# EAGLE schematic Rage Bridge v2 Schematic v58 (EAGLE 9.7.0)
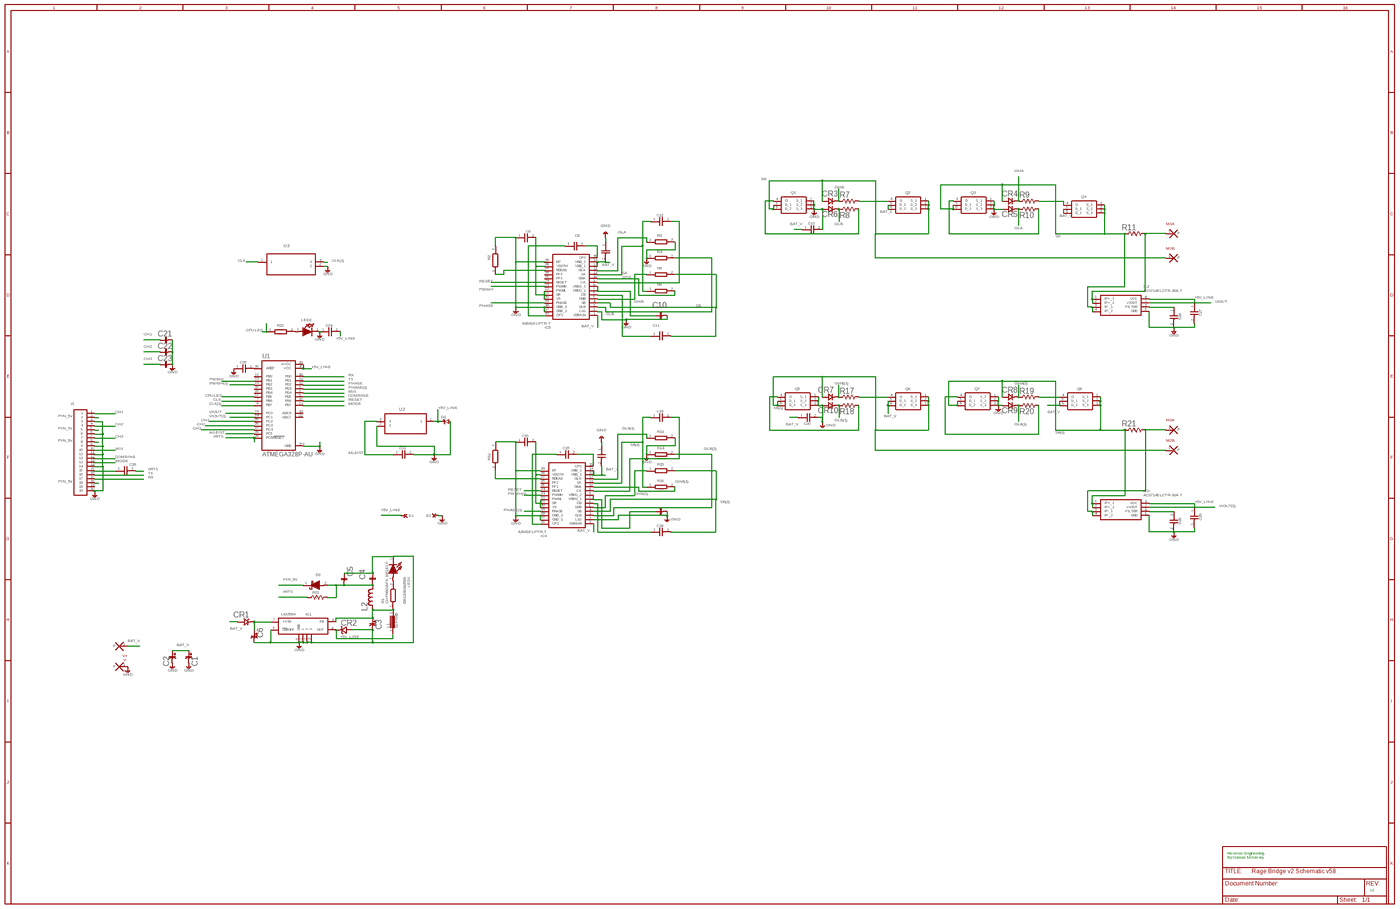
[diagram p0: schematic, sheet 1, overview]
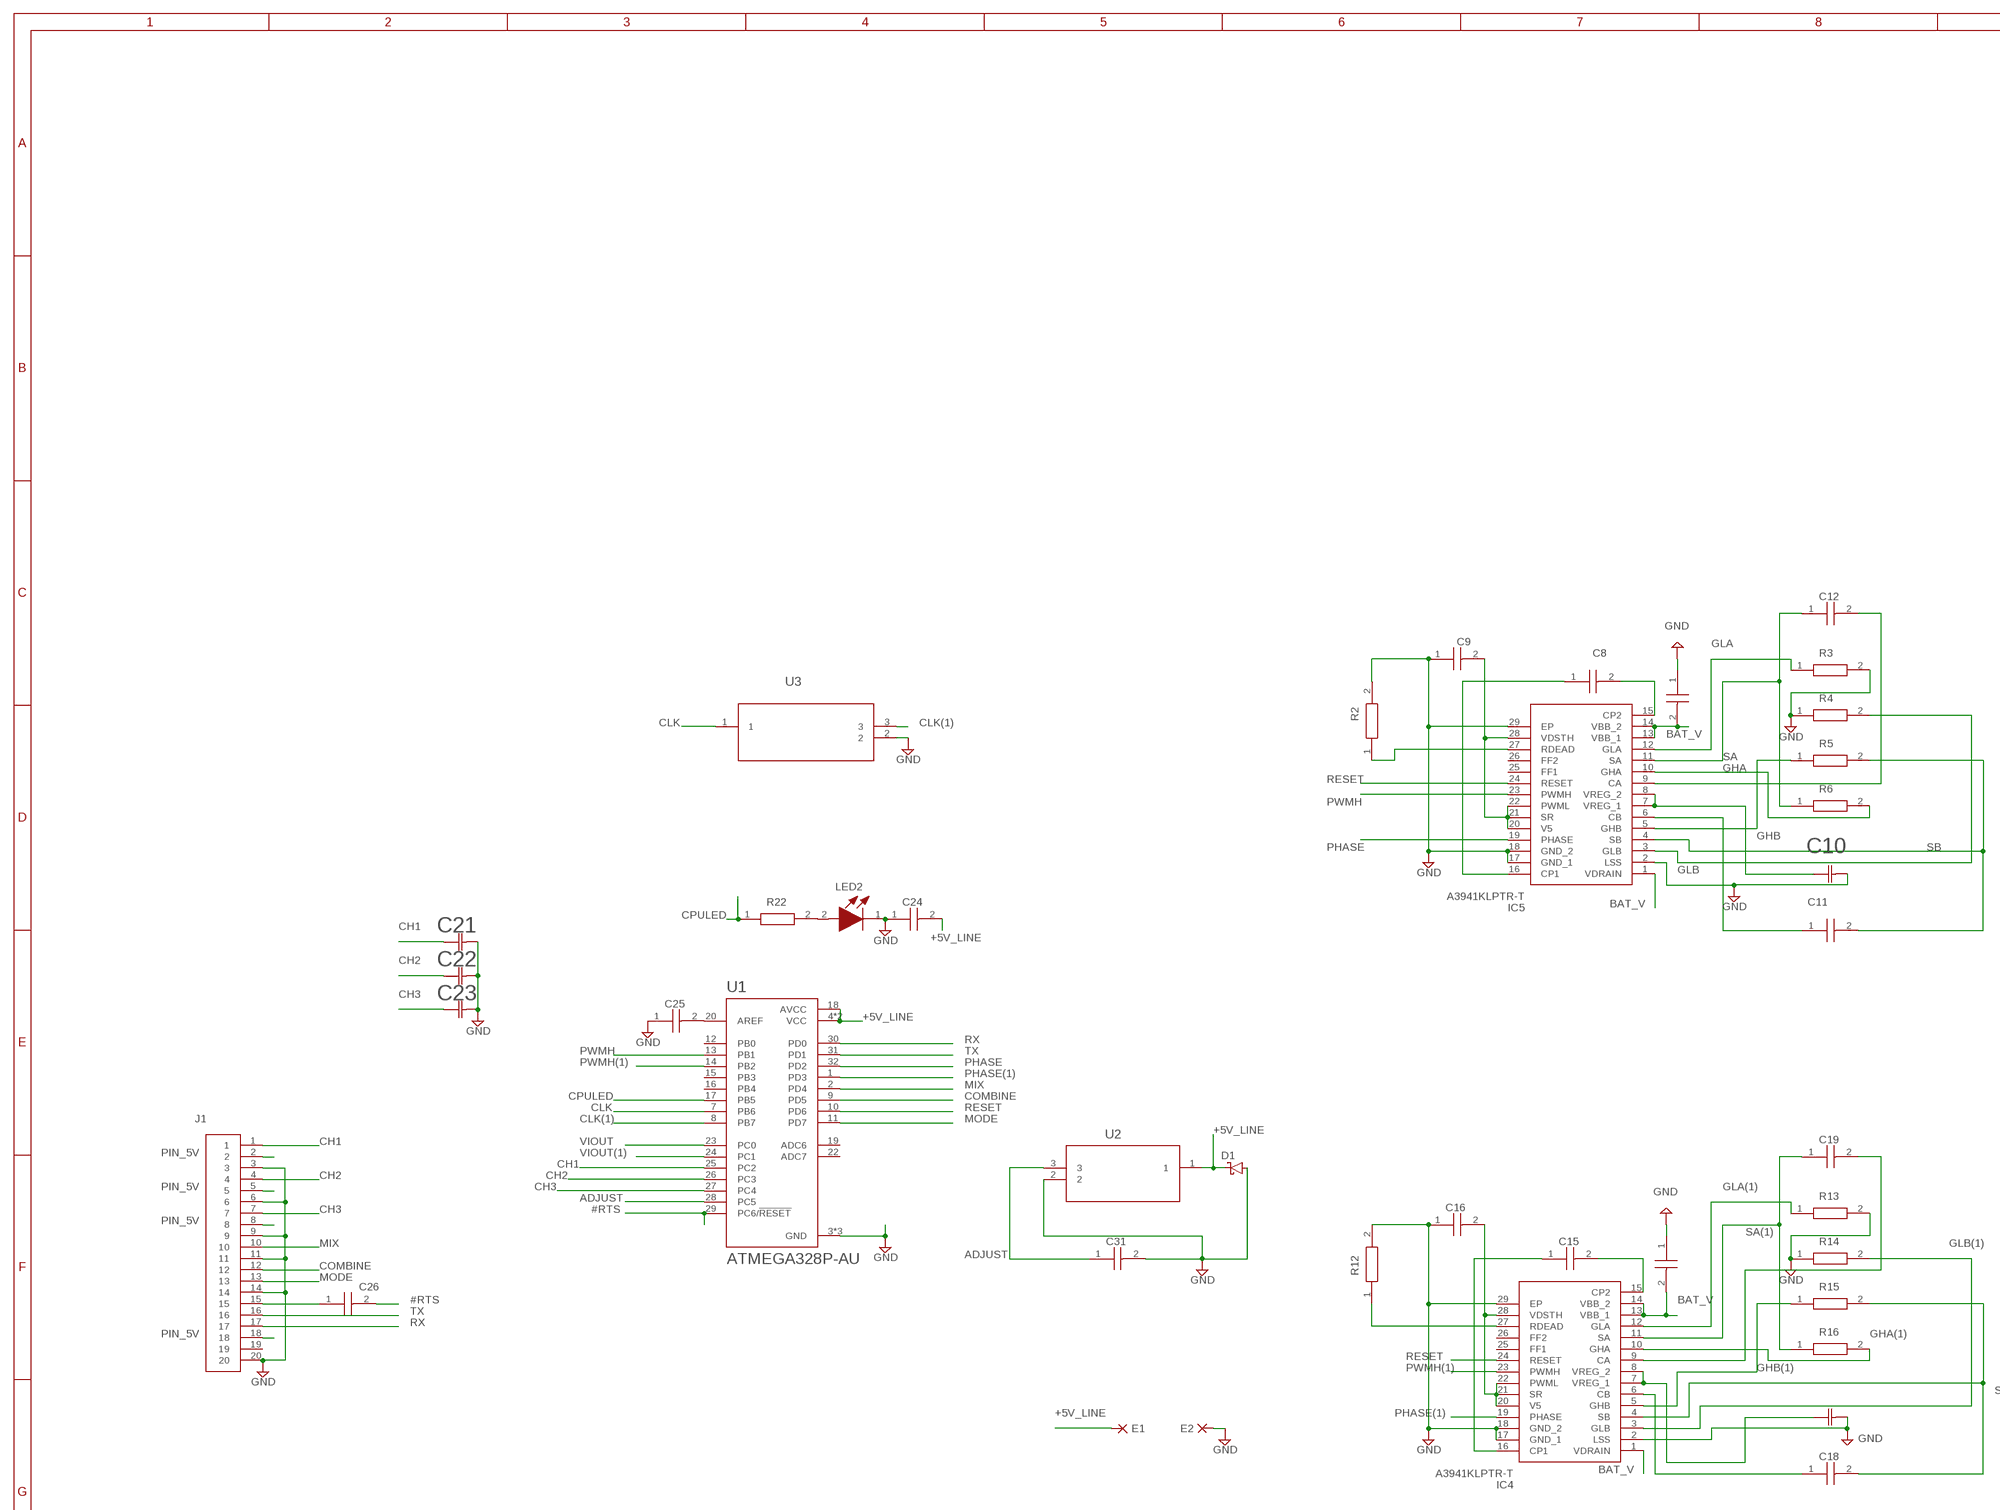
[diagram p1: schematic, sheet 1, part 1 of 4]
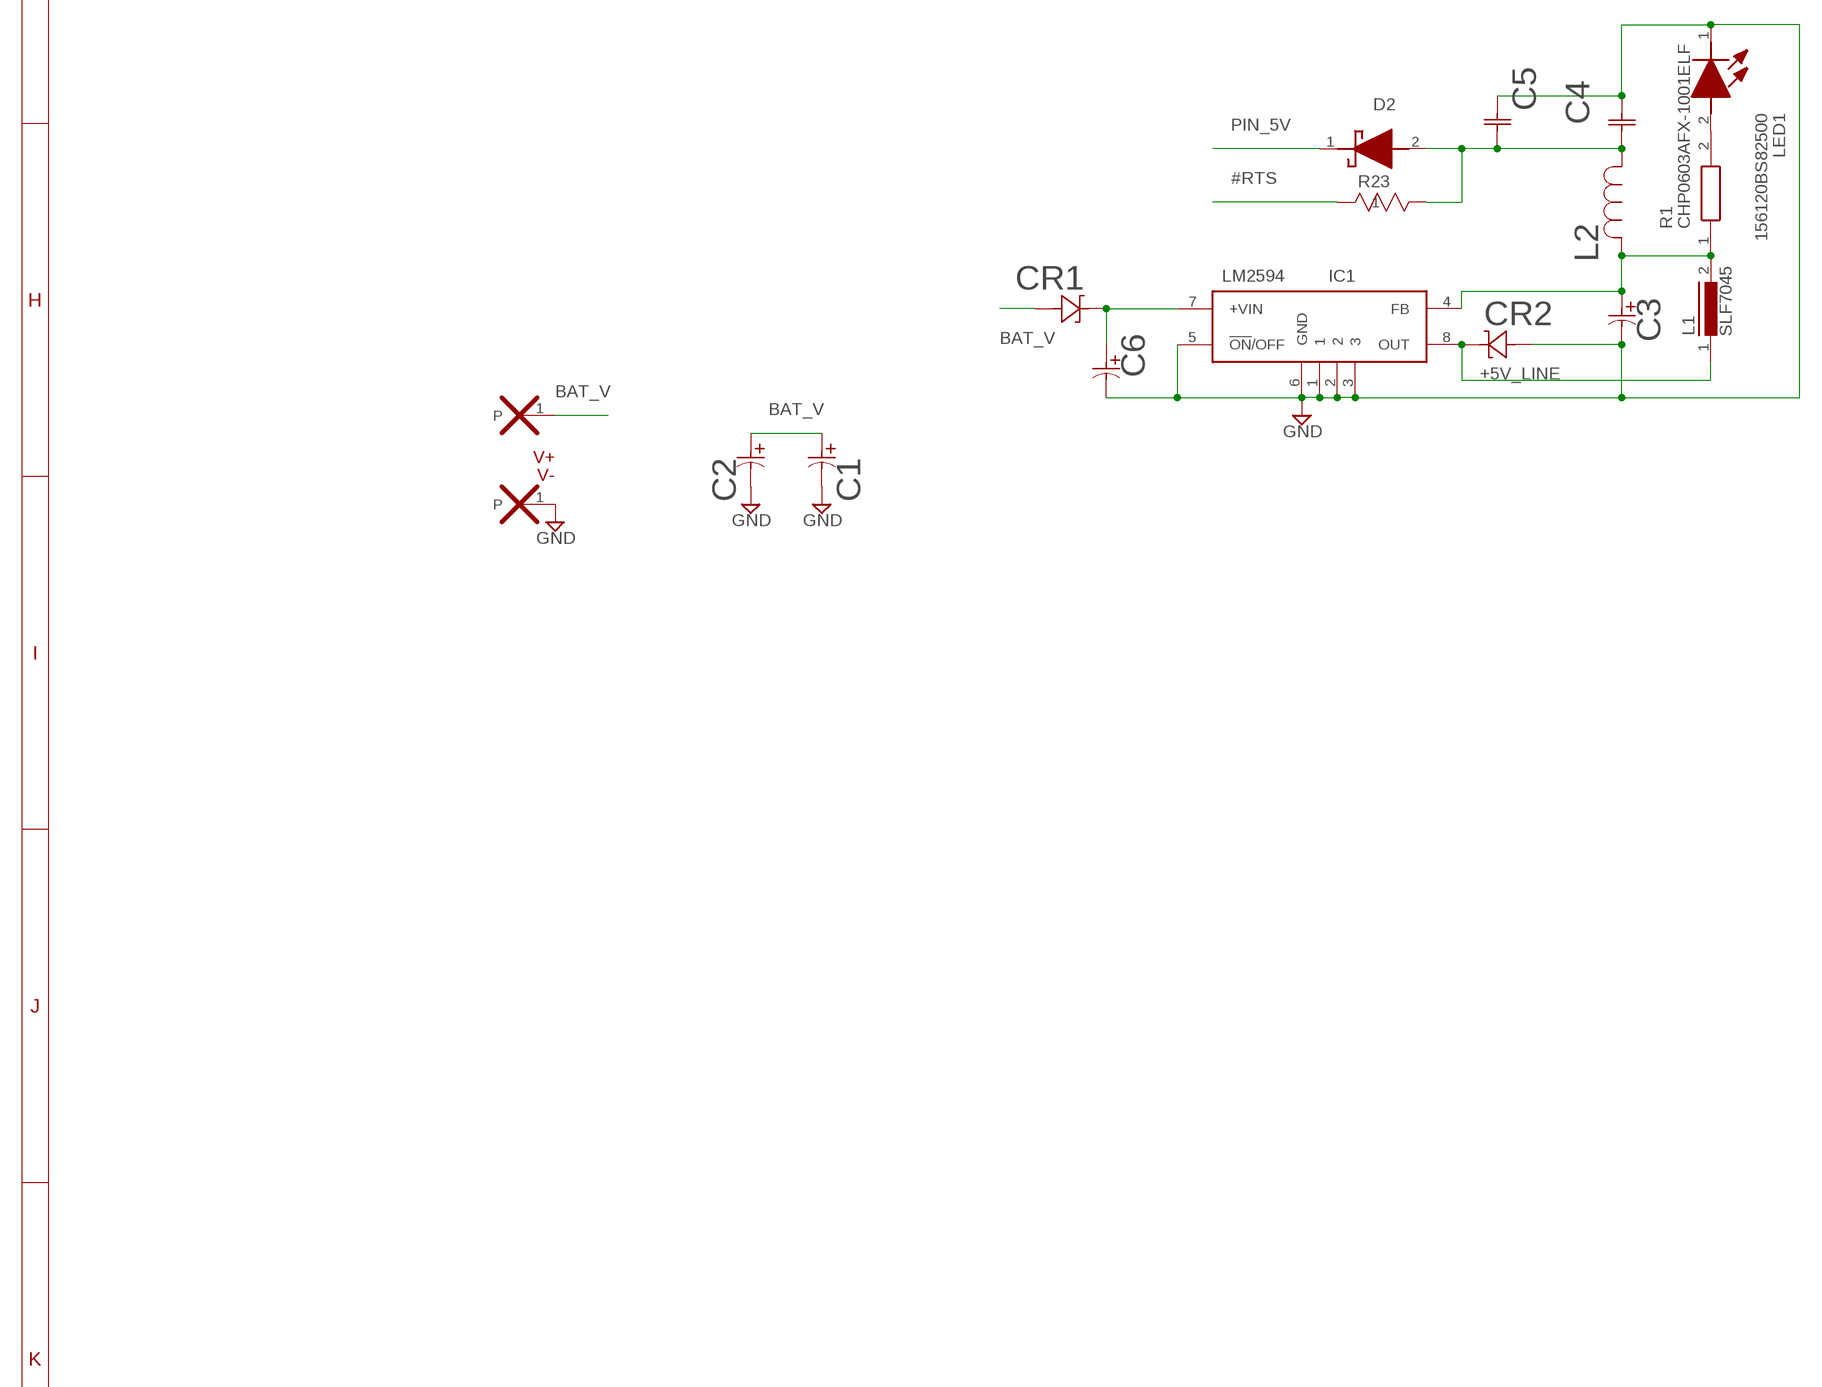
[diagram p2: schematic, sheet 1, part 2 of 4]
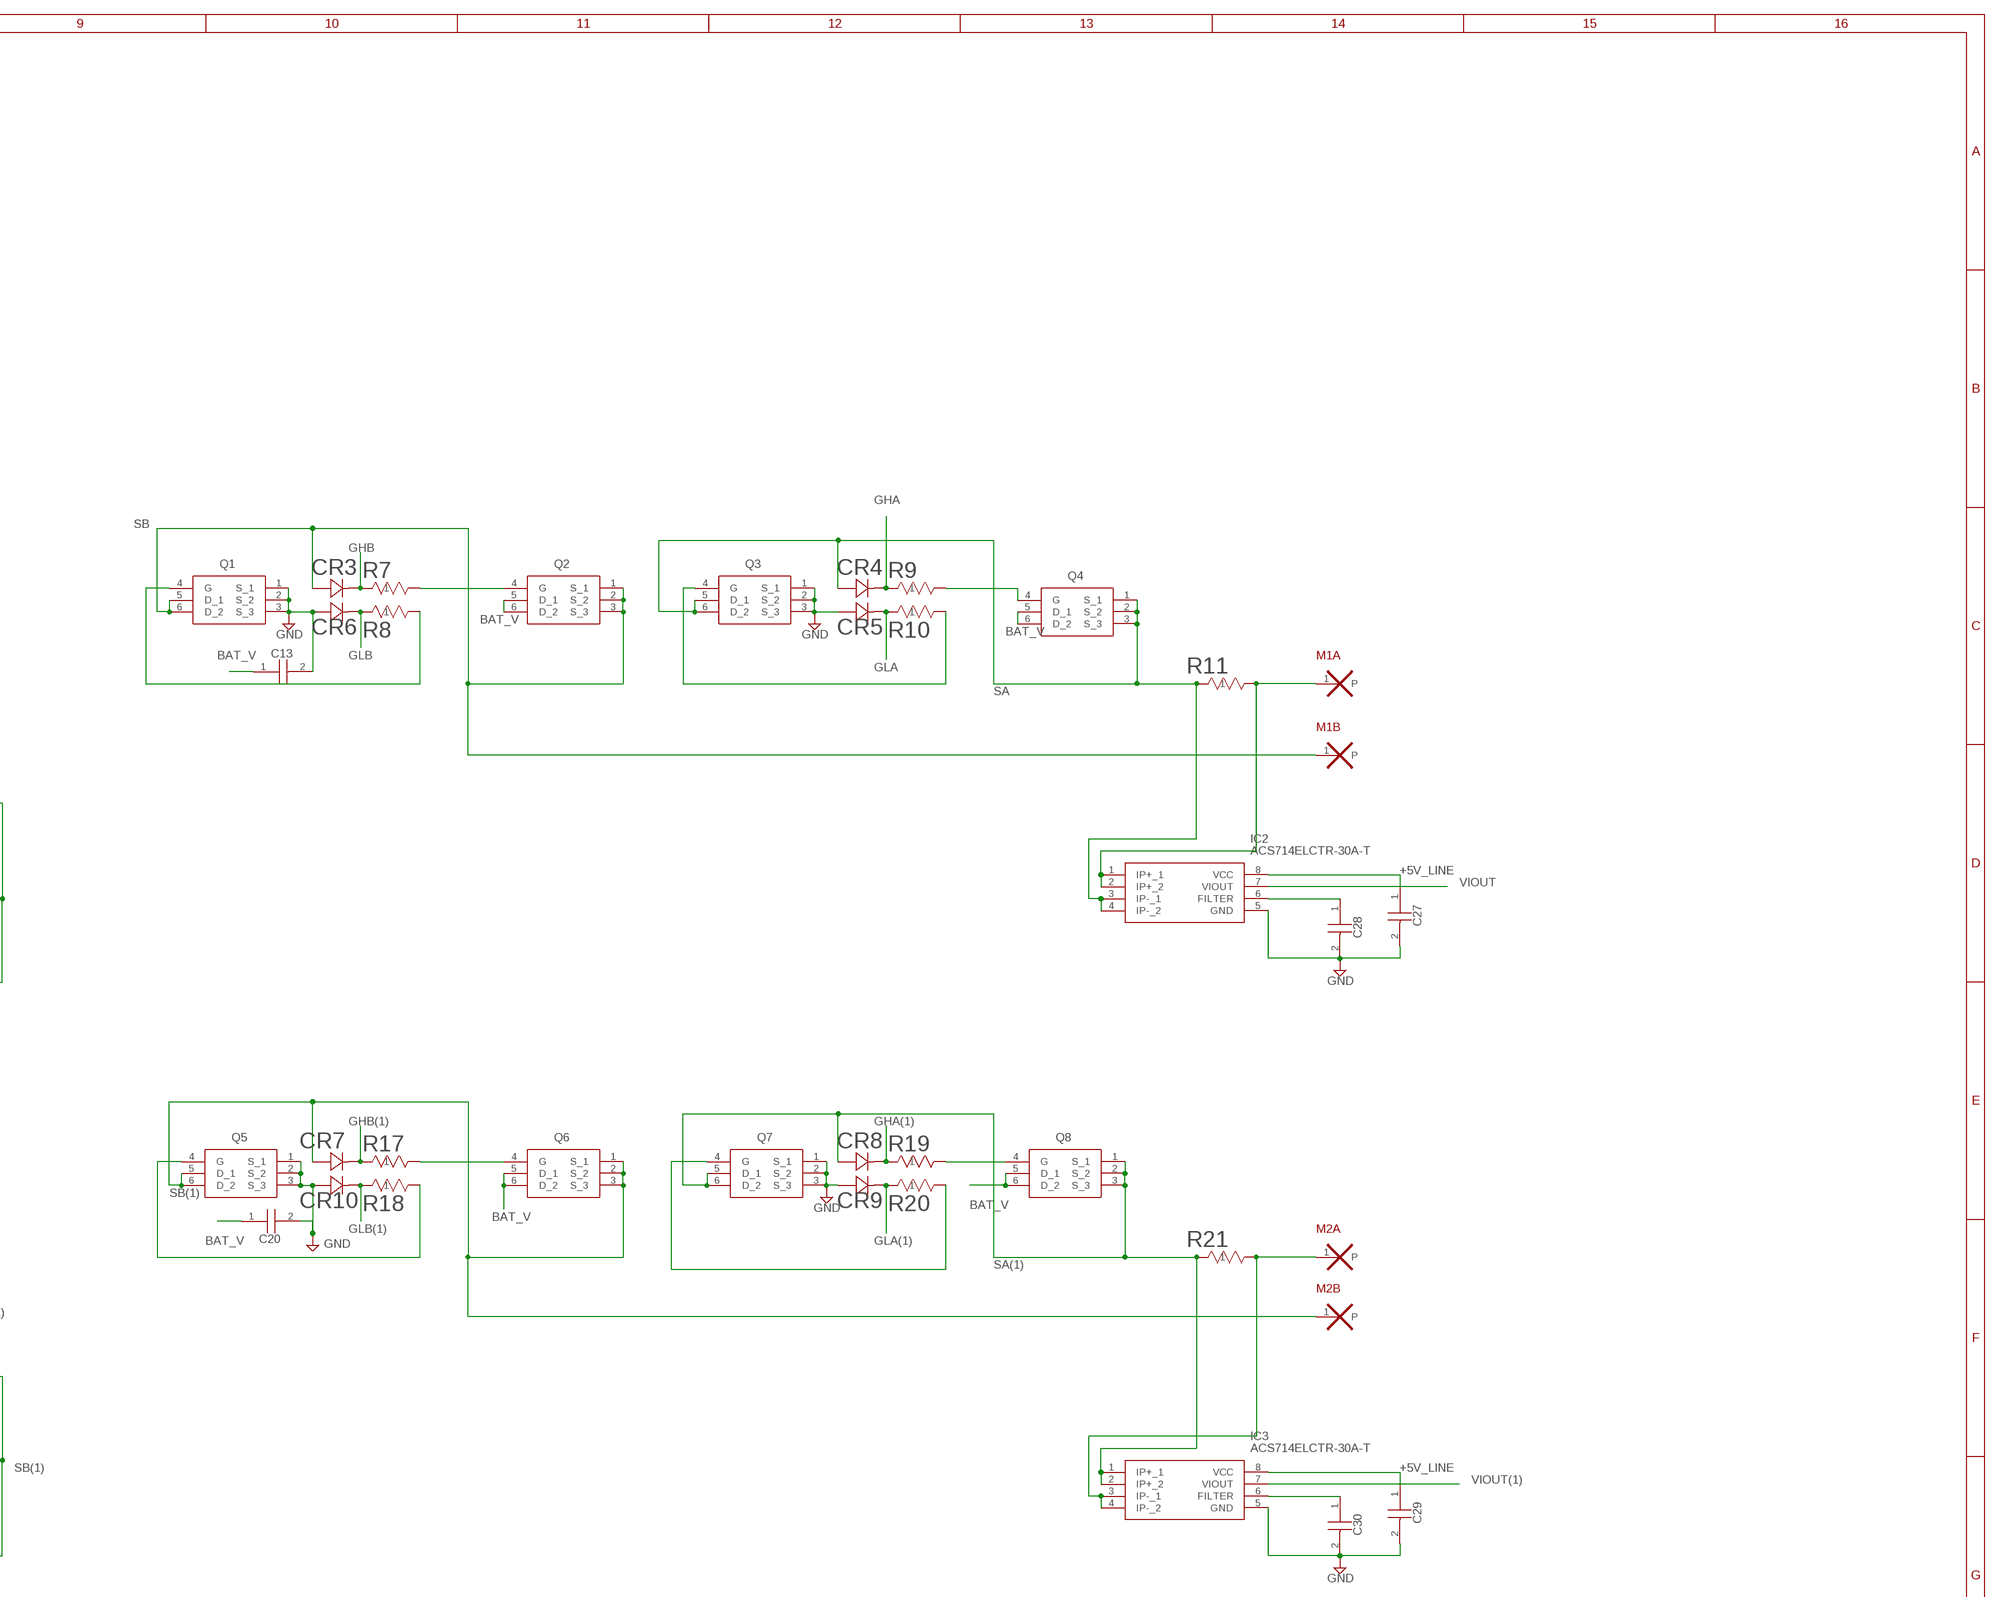
[diagram p3: schematic, sheet 1, part 3 of 4]
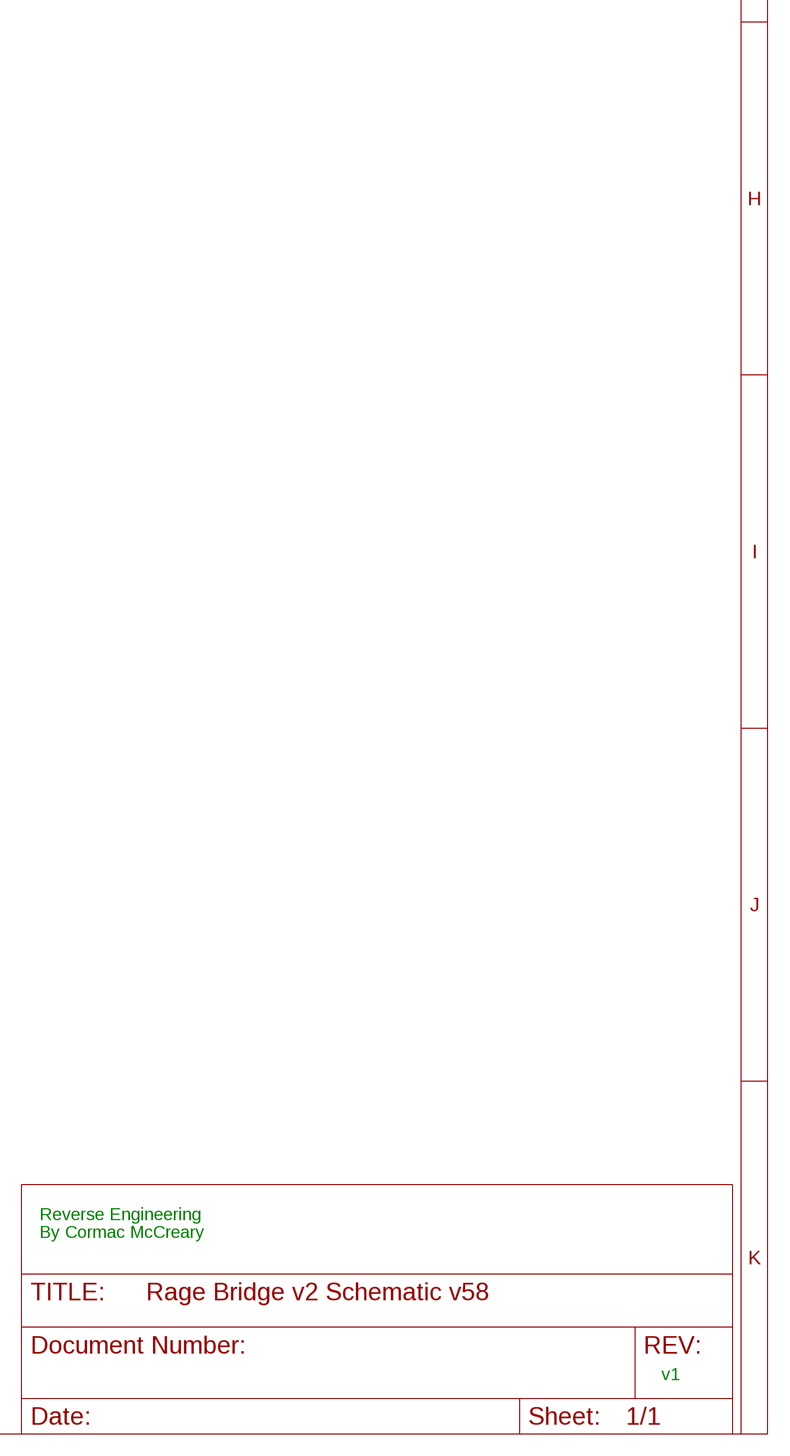
[diagram p4: schematic, sheet 1, part 4 of 4]

## Parts
C1  EEE-HD1V152AMCAP_PAN_EEE_J16_PAN-L  [CAP_PAN_EEE_J16_PAN-L]
C2  EEE-HD1V152AMCAP_PAN_EEE_J16_PAN-L  [CAP_PAN_EEE_J16_PAN-L]
C3  EEE-HA1C101WPCAP_PAN_EEE_D_PAN-L  [CAP_PAN_EEE_D_PAN-L]
C4  12066D107MAT2ACAP_1206X_AVX-L  [CAP_1206X_AVX-L]
C5  08056C104JAT2ACAP_08051A0R8CAT2A_AVX-L  [CAP_08051A0R8CAT2A_AVX-L]
C6  EEE-1VA470WAPCAP_PAN_EEE_D_PAN-L  [CAP_PAN_EEE_D_PAN-L]
C7  06035C105KAT2A  [CAPC1608X90N]
C8  06035C105KAT2A  [CAPC1608X90N]
C9  06035C105KAT2A  [CAPC1608X90N]
C10  08056C104JAT2ACAP_08051A0R8CAT2A_AVX-L  [CAP_08051A0R8CAT2A_AVX-L]
C11  06035C105KAT2A  [CAPC1608X90N]
C12  06035C105KAT2A  [CAPC1608X90N]
C13  06035C105KAT2A  [CAPC1608X90N]
C14  06035C105KAT2A  [CAPC1608X90N]
C15  06035C105KAT2A  [CAPC1608X90N]
C16  06035C105KAT2A  [CAPC1608X90N]
C17  08056C104JAT2ACAP_08051A0R8CAT2A_AVX-L  [CAP_08051A0R8CAT2A_AVX-L]
C18  06035C105KAT2A  [CAPC1608X90N]
C19  06035C105KAT2A  [CAPC1608X90N]
C20  06035C105KAT2A  [CAPC1608X90N]
C21  06036A152JAT2ACAP_06033D104JAT2A-L  [CAP_06033D104JAT2A-L]
C22  06036A152JAT2ACAP_06033D104JAT2A-L  [CAP_06033D104JAT2A-L]
C23  06036A152JAT2ACAP_06033D104JAT2A-L  [CAP_06033D104JAT2A-L]
C24  06035C105KAT2A  [CAPC1608X90N]
C25  06035C105KAT2A  [CAPC1608X90N]
C26  GCM188R71C104KA37J  [CAPC1608X90N]
C27  C0603X102K5GACAUTO  [CAPC1608X95N]
C28  06035C105KAT2A  [CAPC1608X90N]
C29  C0603X102K5GACAUTO  [CAPC1608X95N]
C30  06035C105KAT2A  [CAPC1608X90N]
C31  C0603X102K5GACAUTO  [CAPC1608X95N]
CR1  STPS0560ZSOD-123_STM  [SOD-123_STM]
CR2  STPS0560ZSOD-123_STM-L  [SOD-123_STM-L]
CR3  SMF16ASMFSERIES_LTF-L  [SMFSERIES_LTF-L]
CR4  SMF16ASMFSERIES_LTF-L  [SMFSERIES_LTF-L]
CR5  SMF16ASMFSERIES_LTF-L  [SMFSERIES_LTF-L]
CR6  SMF16ASMFSERIES_LTF-L  [SMFSERIES_LTF-L]
CR7  SMF16ASMFSERIES_LTF-L  [SMFSERIES_LTF-L]
CR8  SMF16ASMFSERIES_LTF-L  [SMFSERIES_LTF-L]
CR9  SMF16ASMFSERIES_LTF-L  [SMFSERIES_LTF-L]
CR10  SMF16ASMFSERIES_LTF-L  [SMFSERIES_LTF-L]
D1  SMF5.0AT1  [SOD123FL]
D2  SD0805S020S1R0  [SD0805S020S1R0]
E1  DPADS_PAD-0400-S  [DPADS_0400-S]
E2  DPADS_PAD-0400-S  [DPADS_0400-S]
IC1  LM2594  [TSOP8]
IC2  ACS714ELCTR-30A-T  [ACS711ELCTR25ABT]
IC3  ACS714ELCTR-30A-T  [ACS711ELCTR25ABT]
IC4  A3941KLPTR-T  [A3944KLPTRT]
IC5  A3941KLPTR-T  [A3944KLPTRT]
J1  61302011121  [61302011121]
L1  SLF7045  [SLF7045]
L2  NLFV32T-3R3M-EFIND_NLFV32T_TDK  [IND_NLFV32T_TDK]
LED1  156120BS82500  [LEDC3216X195N]
LED2  156120BS82500  [LEDC3216X195N]
M1A  4.95/3.55WIREPAD  [4.95/3.55]
M1B  4.95/3.55WIREPAD  [4.95/3.55]
M2A  4.95/3.55WIREPAD  [4.95/3.55]
M2B  4.95/3.55WIREPAD  [4.95/3.55]
Q1  PSMNR90-40YLHX  [PSMN2R055YLHX]
Q2  PSMNR90-40YLHX  [PSMN2R055YLHX]
Q3  PSMNR90-40YLHX  [PSMN2R055YLHX]
Q4  PSMNR90-40YLHX  [PSMN2R055YLHX]
Q5  PSMNR90-40YLHX  [PSMN2R055YLHX]
Q6  PSMNR90-40YLHX  [PSMN2R055YLHX]
Q7  PSMNR90-40YLHX  [PSMN2R055YLHX]
Q8  PSMNR90-40YLHX  [PSMN2R055YLHX]
R1  CHP0603AFX-1001ELF  [RESC1608X55N]
R2  ERA-3VEB2202V  [ERA3KV_(0603)]
R3  CR0603-FX-2703ELF  [RESC1608X55N]
R4  CR0603-FX-2703ELF  [RESC1608X55N]
R5  CR0603-FX-2703ELF  [RESC1608X55N]
R6  CR0603-FX-2703ELF  [RESC1608X55N]
R7  TNPW0603100KBEEARES_TNPW0603_VIS-L  [RES_TNPW0603_VIS-L]
R8  TNPW0603100KBEEARES_TNPW0603_VIS-L  [RES_TNPW0603_VIS-L]
R9  TNPW0603100KBEEARES_TNPW0603_VIS-L  [RES_TNPW0603_VIS-L]
R10  TNPW0603100KBEEARES_TNPW0603_VIS-L  [RES_TNPW0603_VIS-L]
R11  CSNL2512FTL500STA_CSNL2512(0.5)_STP-L  [STA_CSNL2512(0.5)_STP-L]
R12  ERA-3VEB2202V  [ERA3KV_(0603)]
R13  CR0603-FX-2703ELF  [RESC1608X55N]
R14  CR0603-FX-2703ELF  [RESC1608X55N]
R15  CR0603-FX-2703ELF  [RESC1608X55N]
R16  CR0603-FX-2703ELF  [RESC1608X55N]
R17  TNPW0603100KBEEARES_TNPW0603_VIS-L  [RES_TNPW0603_VIS-L]
R18  TNPW0603100KBEEARES_TNPW0603_VIS-L  [RES_TNPW0603_VIS-L]
R19  TNPW0603100KBEEARES_TNPW0603_VIS-L  [RES_TNPW0603_VIS-L]
R20  TNPW0603100KBEEARES_TNPW0603_VIS-L  [RES_TNPW0603_VIS-L]
R21  CSNL2512FTL500STA_CSNL2512(0.5)_STP-L  [STA_CSNL2512(0.5)_STP-L]
R22  CHP0603AFX-1001ELF  [RESC1608X55N]
R23  CHP0603AFX-1003ELFRES_CHP0603_BRN-L  [RES_CHP0603_BRN-L]
U1  ATMEGA328P-AU  [QFP80P900X900X120-32N]
U2  ST-4ETB502ST-4ETB502_NDC-L  [ST-4ETB502_NDC-L]
U3  CSTCE16M0V53A-R0CSTCE_V_MUR  [CSTCE_V_MUR]
V+  4.95/3.55WIREPAD  [4.95/3.55]
V-  4.95/3.55WIREPAD  [4.95/3.55]

## Nets
#RTS: C26.2 R23.1 U1.29(PC6/!RESET)
+5V_LINE: C4.1 C5.2 C24.2 C27.1 C29.1 D1.C D2.2(A) E1.PAD(P) IC2.8(VCC) IC3.8(VCC) L2.1 R23.2 U1.4(VCC) U1.6(VCC) U1.18(AVCC) U2.1
ADJUST: C31.1 U1.28(PC5) U2.3
BAT_V: C1.1 C2.1 C7.2 C13.1 C14.2 C20.1 CR1.2 IC4.1(VDRAIN) IC4.13(VBB_1) IC4.14(VBB_2) IC5.1(VDRAIN) IC5.13(VBB_1) IC5.14(VBB_2) Q2.5(D_1) Q2.6(D_2) Q4.5(D_1) Q4.6(D_2) Q6.5(D_1) Q6.6(D_2) Q8.5(D_1) Q8.6(D_2) V+.1(P)
CH1: C21.1(EPAD) J1.1 U1.25(PC2)
CH2: C22.1(EPAD) J1.4 U1.26(PC3)
CH3: C23.1(EPAD) J1.7 U1.27(PC4)
CLK: U1.7(PB6) U3.1
CLK(1): U1.8(PB7) U3.3
COMBINE: J1.12 U1.9(PD5)
CPULED: R22.1 U1.17(PB5)
GHA: CR4.1 IC5.10(GHA) R6.2 R9.1
GHA(1): CR8.1 IC4.10(GHA) R16.2 R19.1
GHB: CR3.1 IC5.5(GHB) R5.1 R7.1
GHB(1): CR7.1 IC4.5(GHB) R15.1 R17.1
GLA: CR5.1 IC5.12(GLA) R3.1 R10.1
GLA(1): CR9.1 IC4.12(GLA) R13.1 R20.1
GLB: CR6.1 IC5.3(GLB) R4.2 R8.1
GLB(1): CR10.1 IC4.3(GLB) R14.2 R18.1
GND: C1.2 C2.2 C3.2 C4.2 C5.1 C6.2 C7.1 C9.1 C10.2 C13.2 C14.1 C16.1 C17.2 C20.2 C21.2(EPAD_2) C22.2(EPAD_2) C23.2(EPAD_2) C24.1 C25.1 C27.2 C28.2 C29.2 C30.2 C31.2 CR2.2 CR5.2 CR6.2 CR9.2 CR10.2 D1.A E2.PAD(P) IC1.1 IC1.2 IC1.3 IC1.5(!ON!/OFF) IC1.6(GND) IC2.5(GND) IC3.5(GND) IC4.2(LSS) IC4.17(GND_1) IC4.18(GND_2) IC4.29(EP) IC5.2(LSS) IC5.17(GND_1) IC5.18(GND_2) IC5.29(EP) J1.3 J1.6 J1.9 J1.11 J1.14 J1.20 LED1.1(K) LED2.1(K) Q1.1(S_1) Q1.2(S_2) Q1.3(S_3) Q3.1(S_1) Q3.2(S_2) Q3.3(S_3) Q5.1(S_1) Q5.2(S_2) Q5.3(S_3) Q7.1(S_1) Q7.2(S_2) Q7.3(S_3) R2.2 R3.2 R4.1 R12.2 R13.2 R14.1 U1.3(GND) U1.5(GND) U1.21(GND) U2.2 U3.2 V-.1(P)
MIX: J1.10 U1.2(PD4)
MODE: J1.13 U1.11(PD7)
N$1: C12.2 IC5.9(CA)
N$2: C8.2 IC5.15(CP2)
N$3: C6.1 CR1.1 IC1.7(+VIN)
N$5: CR2.1 IC1.8(OUT) L1.1
N$6: C3.1 IC1.4(FB) L1.2 L2.2 R1.1
N$7: IC2.1(IP+_1) IC2.2(IP+_2) M1A.1(P) R11.2
N$8: LED1.2(A) R1.2
N$9: IC5.27(RDEAD) R2.1
N$11: C11.1 IC5.6(CB)
N$12: C17.1 IC4.7(VREG_1) IC4.8(VREG_2)
N$15: Q2.4(G) R7.2
N$16: Q8.4(G) R19.2
N$18: C16.2 IC4.20(V5) IC4.21(SR) IC4.22(PWML) IC4.28(VDSTH)
N$22: C15.1 IC4.16(CP1)
N$23: C15.2 IC4.15(CP2)
N$24: IC3.3(IP-_1) IC3.4(IP-_2) M2A.1(P) R21.2
N$29: Q6.4(G) R17.2
N$31: Q1.4(G) R8.2
N$32: Q3.4(G) R10.2
N$33: C26.1 J1.15
N$34: IC4.27(RDEAD) R12.1
N$35: C10.1 IC5.7(VREG_1) IC5.8(VREG_2)
N$36: C8.1 IC5.16(CP1)
N$39: C9.2 IC5.20(V5) IC5.21(SR) IC5.22(PWML) IC5.28(VDSTH)
N$41: C19.2 IC4.9(CA)
N$42: C18.1 IC4.6(CB)
N$49: Q5.4(G) R18.2
N$50: Q7.4(G) R20.2
N$52: C28.1 IC2.6(FILTER)
N$61: LED2.2(A) R22.2
N$63: C25.2 U1.20(AREF)
N$73: C30.1 IC3.6(FILTER)
N$79: Q4.4(G) R9.2
PHASE: IC5.19(PHASE) U1.32(PD2)
PHASE(1): IC4.19(PHASE) U1.1(PD3)
PIN_5V: D2.1(K) J1.2 J1.5 J1.8 J1.18
PWMH: IC5.23(PWMH) U1.13(PB1)
PWMH(1): IC4.23(PWMH) U1.14(PB2)
RESET: IC4.24(RESET) IC5.24(RESET) U1.10(PD6)
RX: J1.17 U1.30(PD0)
SA: C12.1 CR4.2 IC2.3(IP-_1) IC2.4(IP-_2) IC5.11(SA) Q3.5(D_1) Q3.6(D_2) Q4.1(S_1) Q4.2(S_2) Q4.3(S_3) R6.1 R11.1
SA(1): C19.1 CR8.2 IC3.1(IP+_1) IC3.2(IP+_2) IC4.11(SA) Q7.5(D_1) Q7.6(D_2) Q8.1(S_1) Q8.2(S_2) Q8.3(S_3) R16.1 R21.1
SB: C11.2 CR3.2 IC5.4(SB) M1B.1(P) Q1.5(D_1) Q1.6(D_2) Q2.1(S_1) Q2.2(S_2) Q2.3(S_3) R5.2
SB(1): C18.2 CR7.2 IC4.4(SB) M2B.1(P) Q5.5(D_1) Q5.6(D_2) Q6.1(S_1) Q6.2(S_2) Q6.3(S_3) R15.2
TX: J1.16 U1.31(PD1)
VIOUT: IC2.7(VIOUT) U1.23(PC0)
VIOUT(1): IC3.7(VIOUT) U1.24(PC1)
Unconnected: IC4.25(FF1) IC4.26(FF2) IC5.25(FF1) IC5.26(FF2) J1.19 U1.12(PB0) U1.15(PB3) U1.16(PB4) U1.19(ADC6) U1.22(ADC7)

## Notes on the sheet
- Reverse Engineering
- By Cormac McCreary
- v1

## Library data of the parts
C1 C2 = Library:EEE-HD1V152AM; COPYRIGHT: Copyright (C) 2023 Ultra Librarian. All rights reserved.; MANUFACTURER_PART_NUMBER: EEE-HD1V152AM; MFR_NAME: Panasonic
C3 = Modified Parts:EEE-HA1C101WP; COPYRIGHT: Copyright (C) 2023 Ultra Librarian. All rights reserved.; DIGI-KEY_PART_NUMBER_1: PCE4180TR-ND; DIGI-KEY_PART_NUMBER_2: PCE4180CT-ND; DIGI-KEY_PART_NUMBER_3: PCE4180DKR-ND; MANUFACTURER_PART_NUMBER: EEE-HA1C101WP; MFR_NAME: Panasonic
C4 = 581-12066D107MAT2A:12066D107MAT2A; COPYRIGHT: Copyright (C) 2023 Ultra Librarian. All rights reserved.; MANUFACTURER_PART_NUMBER: 12066D107MAT2A; MFR_NAME: KYOCERA AVX
C5 C10 C17 = 08056C106MAT2A:08056C104JAT2A; COPYRIGHT: Copyright (C) 2023 Ultra Librarian. All rights reserved.; MANUFACTURER_PART_NUMBER: 08056C104JAT2A; MFR_NAME: KYOCERA AVX
C6 = Modified Parts:EEE-1VA470WAP; COPYRIGHT: Copyright (C) 2023 Ultra Librarian. All rights reserved.; MANUFACTURER_PART_NUMBER: EEE-1VA470WAP; MFR_NAME: Panasonic
C7-C9 C11-C16 C18-C20 C24 C25 C28 C30 = 06035C105KAT2A:06035C105KAT2A: Multilayer Ceramic Capacitors MLCC - SMD/SMT 1.0UF 50V 10% 0603 Source: Datasheet <https://componentsearchengine.com/Datasheets/1/06031A100FAT2A.pdf>; DESCRIPTION: Multilayer Ceramic Capacitors MLCC - SMD/SMT 1.0UF 50V 10% 0603; HEIGHT: 0.9mm; MANUFACTURER_NAME: AVX; MANUFACTURER_PART_NUMBER: 06035C105KAT2A; MOUSER_PART_NUMBER: 581-06035C105KAT2A; MOUSER_PRICE-STOCK: https://www.mouser.co.uk/ProductDetail/AVX/06035C105KAT2A/?qs=%252BdQmOuGyFcGCdIIWh6fU7Q%3D%3D
C21-C23 = 06036A152JAT2A:06036A152JAT2A; COPYRIGHT: Copyright (C) 2023 Ultra Librarian. All rights reserved.; MANUFACTURER_PART_NUMBER: 06036A152JAT2A; MFR_NAME: KYOCERA AVX
C26 = GCM188R71C104KA37J:GCM188R71C104KA37J: Multilayer Ceramic Capacitors MLCC - SMD/SMT .1uF 16Volts 10% Source: Datasheet <https://datasheet.datasheetarchive.com/originals/distributors/Datasheets_SAMA/6a84f22995587894cf4220b9e75711fd.pdf>; DESCRIPTION: Multilayer Ceramic Capacitors MLCC - SMD/SMT .1uF 16Volts 10%; HEIGHT: 0.9mm; MANUFACTURER_NAME: Murata Electronics; MANUFACTURER_PART_NUMBER: GCM188R71C104KA37J; MOUSER_PART_NUMBER: 81-GCM188R71C104KA7J; MOUSER_PRICE-STOCK: https://www.mouser.co.uk/ProductDetail/Murata-Electronics/GCM188R71C104KA37J?qs=bGEzvQhTDnZD08oWyjLpYQ%3D%3D
C27 C29 C31 = C0603X102K5GACAUTO:C0603X102K5GACAUTO: SMD Auto C0G Flex, Ceramic, 1000 pF, 10%, 50 VDC, 125 VDC, 125C, -55C, C0G, SMD, MLCC, FT-CAP, Ultra-Stable, Automotive Grade, 0.1 % , 100 GOhms, 4.6 mg, 0603, 1.6mm, 0.8mm, 0.8mm, 0.58mm, 0.45mm, 4000, 78 Weeks, 120 Source: Datasheet <https://content.kemet.com/datasheets/KEM_C1062_C0G_FT-CAP_SMD.pdf>; DESCRIPTION: SMD Auto C0G Flex, Ceramic, 1000 pF, 10%, 50 VDC, 125 VDC, 125C, -55C, C0G, SMD, MLCC, FT-CAP, Ultra-Stable, Automotive Grade, 0.1 % , 100 GOhms, 4.6 mg, 0603, 1.6mm, 0.8mm, 0.8mm, 0.58mm, 0.45mm, 4000, 78 Weeks, 120; HEIGHT: 0.95mm; MANUFACTURER_NAME: KEMET; MANUFACTURER_PART_NUMBER: C0603X102K5GACAUTO; MOUSER_PART_NUMBER: 80-C0603X102K5GAUTO; MOUSER_PRICE-STOCK: https://www.mouser.co.uk/ProductDetail/KEMET/C0603X102K5GACAUTO?qs=Rp5uXu7WBW%2FQ943CZtK%2F6w%3D%3D
CR1 CR2 = Modified Parts:STPS0560Z; COPYRIGHT: Copyright (C) 2023 Ultra Librarian. All rights reserved.; MANUFACTURER_PART_NUMBER: STPS0560Z; MFR_NAME: STMicroelectronics
CR3-CR10 = Modified Parts:SMF16A; COPYRIGHT: Copyright (C) 2023 Ultra Librarian. All rights reserved.; MANUFACTURER_PART_NUMBER: SMF16A; MFR_NAME: Littelfuse Inc
D1 = diode:SMF5.0AT1: 200 W Transient Voltage Suppressor Source: Data sheet <http://www.onsemi.com/pub_link/Collateral/SMF5.0AT1-D.PDF>
D2 = SD0805S020S1R0:SD0805S020S1R0: AVX - SD0805S020S1R0 - DIODE, SCHOTTKY, 1A, 20V, SOD-323 Source: Datasheet <https://componentsearchengine.com/Datasheets/1/SD0805S020S1R0.pdf>; DESCRIPTION: AVX - SD0805S020S1R0 - DIODE, SCHOTTKY, 1A, 20V, SOD-323; HEIGHT: 1mm; MANUFACTURER_NAME: AVX; MANUFACTURER_PART_NUMBER: SD0805S020S1R0; MOUSER_PART_NUMBER: 581-SD0805S020S1R0; MOUSER_PRICE-STOCK: https://www.mouser.co.uk/ProductDetail/AVX-Kyocera/SD0805S020S1R0?qs=jCA%252BPfw4LHbpkAoSnwrdjw%3D%3D
E1 E2 = 52101-101-REV-A_v16:DPADS_PAD: WIRE PAD Standard US Drill Sizes and SMD pads; BOM: EXCLUDE
IC1 = LM2594:LM2594: Power Converter 150kHz 0.5A Step-Down Voltage Regulator
IC2 IC3 = ACS714ELCTR-30A-T:ACS714ELCTR-30A-T: Automotive Grade, Fully Integrated, Hall-Effect-Based Linear Current Sensor IC with 2.1 kVRMS Voltage Isolation and a Low-Resistance Current Conductor Source: Datasheet <https://www.allegromicro.com/-/media/files/datasheets/acs714-datasheet.ashx>; ARROW_PART_NUMBER: ACS714ELCTR-30A-T; ARROW_PRICE-STOCK: https://www.arrow.com/en/products/acs714elctr-30a-t/allegro-microsystems?region=nac; DESCRIPTION: Automotive Grade, Fully Integrated, Hall-Effect-Based Linear Current Sensor IC with 2.1 kVRMS Voltage Isolation and a Low-Resistance Current Conductor; HEIGHT: 1.75mm; MANUFACTURER_NAME: Allegro Microsystems; MANUFACTURER_PART_NUMBER: ACS714ELCTR-30A-T
IC4 IC5 = A3941KLPTR-T:A3941KLPTR-T: Automotive Full Bridge MOSFET Driver Source: Datasheet <https://componentsearchengine.com/Datasheets/2/A3941KLPTR-T.pdf>; ARROW_PART_NUMBER: A3941KLPTR-T; ARROW_PRICE-STOCK: https://www.arrow.com/en/products/a3941klptr-t/allegro-microsystems; DESCRIPTION: Automotive Full Bridge MOSFET Driver; HEIGHT: 1.2mm; MANUFACTURER_NAME: Allegro Microsystems; MANUFACTURER_PART_NUMBER: A3941KLPTR-T
J1 = Headers:61302011121: CONN HEADER VERT 20POS 2.54MM Manufacturer's datasheet <https://katalog.we-online.de/em/datasheet/6130xx11121.pdf>; CREATED_BY: PCBLayout.com; DIGIKEY_PART_NUMBER: 732-5329-ND; MANUFACTURER: Wurth Electronics Inc.; MPN: 61302011121
L1 = inductors:SLF7045: SMD Inductors(Coils) For Power Line (Wound, Magnetic Shielded) Source: TDK, e531_slf7045.pdf; SPICEPREFIX: L
L2 = Modified Parts:NLFV32T-3R3M-EF; COPYRIGHT: Copyright (C) 2023 Ultra Librarian. All rights reserved.; MANUFACTURER_PART_NUMBER: NLFV32T-3R3M-EF; MFR_NAME: TDK
LED1 LED2 = 156120BS82500:156120BS82500: 3.9 V Blue LED 3216 (1206) SMD, Wurth Elektronik WL-SMRW 156120BS82500 Source: Datasheet <https://www.we-online.com/catalog/datasheet/156120BS82500.pdf>; DESCRIPTION: 3.9 V Blue LED 3216 (1206) SMD, Wurth Elektronik WL-SMRW 156120BS82500; HEIGHT: 1.95mm; MANUFACTURER_NAME: Wurth Elektronik; MANUFACTURER_PART_NUMBER: 156120BS82500; MOUSER_PART_NUMBER: 710-156120BS82500; MOUSER_PRICE-STOCK: https://www.mouser.co.uk/ProductDetail/Wurth-Elektronik/156120BS82500?qs=5aG0NVq1C4ycHR%252BnBedTqQ%3D%3D
M1A M1B M2A M2B V+ V- = Battery/Output TH:4.95/3.55WIREPAD
Q1-Q8 = PSMNR90-40YLHX:PSMNR90-40YLHX: MOSFET N-CH 40 V LOGIC LEVEL Source: Datasheet <https://assets.nexperia.com/documents/data-sheet/PSMNR90-40YLH.pdf>; DESCRIPTION: MOSFET N-CH 40 V LOGIC LEVEL; HEIGHT: 1.25mm; MANUFACTURER_NAME: Nexperia; MANUFACTURER_PART_NUMBER: PSMNR90-40YLHX; MOUSER_PART_NUMBER: 771-PSMNR90-40YLHX; MOUSER_PRICE-STOCK: https://www.mouser.co.uk/ProductDetail/Nexperia/PSMNR90-40YLHX?qs=Zz7%252BYVVL6bENGG9A3AEHCg%3D%3D
R1 R22 = CHP0603AFX-1001ELF:CHP0603AFX-1001ELF: Thick Film Resistors - SMD ResHighPowerA 0603 1k 1% 1/3W TC100 Source: Datasheet <https://componentsearchengine.com/Datasheets/2/CHP0603AFX-1001ELF.pdf>; DESCRIPTION: Thick Film Resistors - SMD ResHighPowerA 0603 1k 1% 1/3W TC100; HEIGHT: 0.55mm; MANUFACTURER_NAME: Bourns; MANUFACTURER_PART_NUMBER: CHP0603AFX-1001ELF; MOUSER_PART_NUMBER: 652-CHP0603AFX1001EL; MOUSER_PRICE-STOCK: https://www.mouser.co.uk/ProductDetail/Bourns/CHP0603AFX-1001ELF?qs=BJlw7L4Cy79wF3rZ%2FmXmqQ%3D%3D
R2 R12 = 3VEB2202V:ERA-3VEB2202V: Chip Resistor 0603 (1608 Metric) Anti-Sulfur, Automotive AEC-Q200 Thin Film Source: Datasheet <http://industrial.panasonic.com/cdbs/www-data/pdf/RDM0000/RDM0000C331.pdf>; DESCRIPTION: Chip Resistor 0603 (1608 Metric) Anti-Sulfur, Automotive AEC-Q200 Thin Film; HEIGHT: 0.4mm; MANUFACTURER_NAME: Panasonic; MANUFACTURER_PART_NUMBER: ERA-3VEB2202V; MOUSER_PART_NUMBER: 667-ERA-3VEB2202V; MOUSER_PRICE-STOCK: https://www.mouser.co.uk/ProductDetail/Panasonic/ERA-3VEB2202V?qs=OlC7AqGiEDmCEFJMvW451w%3D%3D
R3-R6 R13-R16 = CR0603-FX-2703ELF:CR0603-FX-2703ELF: Thick Film Resistors - SMD 270K ohm 1% Source: Datasheet <https://componentsearchengine.com/Datasheets/1/CR0603-FX-2703ELF.pdf>; DESCRIPTION: Thick Film Resistors - SMD 270K ohm 1%; HEIGHT: 0.55mm; MANUFACTURER_NAME: Bourns; MANUFACTURER_PART_NUMBER: CR0603-FX-2703ELF; MOUSER_PART_NUMBER: 652-CR0603FX-2703ELF
R7-R10 R17-R20 = TNPW060310R0DEEA:TNPW0603100KBEEA; COPYRIGHT: Copyright (C) 2023 Ultra Librarian. All rights reserved.; MANUFACTURER_PART_NUMBER: TNPW0603100KBEEA; MFR_NAME: Vishay
R11 R21 = 2023-12-17_00-40-17_Library:CSNL2512FTL500; COPYRIGHT: Copyright (C) 2023 Ultra Librarian. All rights reserved.; MANUFACTURER_PART_NUMBER: CSNL2512FTL500; MFR_NAME: Stackpole International
R23 = CHP0603AFX-1003ELF:CHP0603AFX-1003ELF; COPYRIGHT: Copyright (C) 2023 Ultra Librarian. All rights reserved.; MANUFACTURER_PART_NUMBER: CHP0603AFX-1003ELF; MFR_NAME: Bourns Electronics
U1 = ATMEGA328P-AU:ATMEGA328P-AU: ATmega Series 20 MHz 32 KB Flash 2 KB SRAM 8-Bit Microcontroller - TQFP-32; MANUFACTURER: Atmel
U2 = ST-4ETB502:ST-4ETB502; COPYRIGHT: Copyright (C) 2023 Ultra Librarian. All rights reserved.; MANUFACTURER_PART_NUMBER: ST-4ETB502; MFR_NAME: Nidec Copal Electronics
U3 = CSTCE16M0V53A-R0:CSTCE16M0V53A-R0; COPYRIGHT: Copyright (C) 2023 Ultra Librarian. All rights reserved.; MANUFACTURER_PART_NUMBER: CSTCE16M0V53A-R0; MFR_NAME: Murata